# EAGLE design motorControllerMk3 (EAGLE 6.5.0)
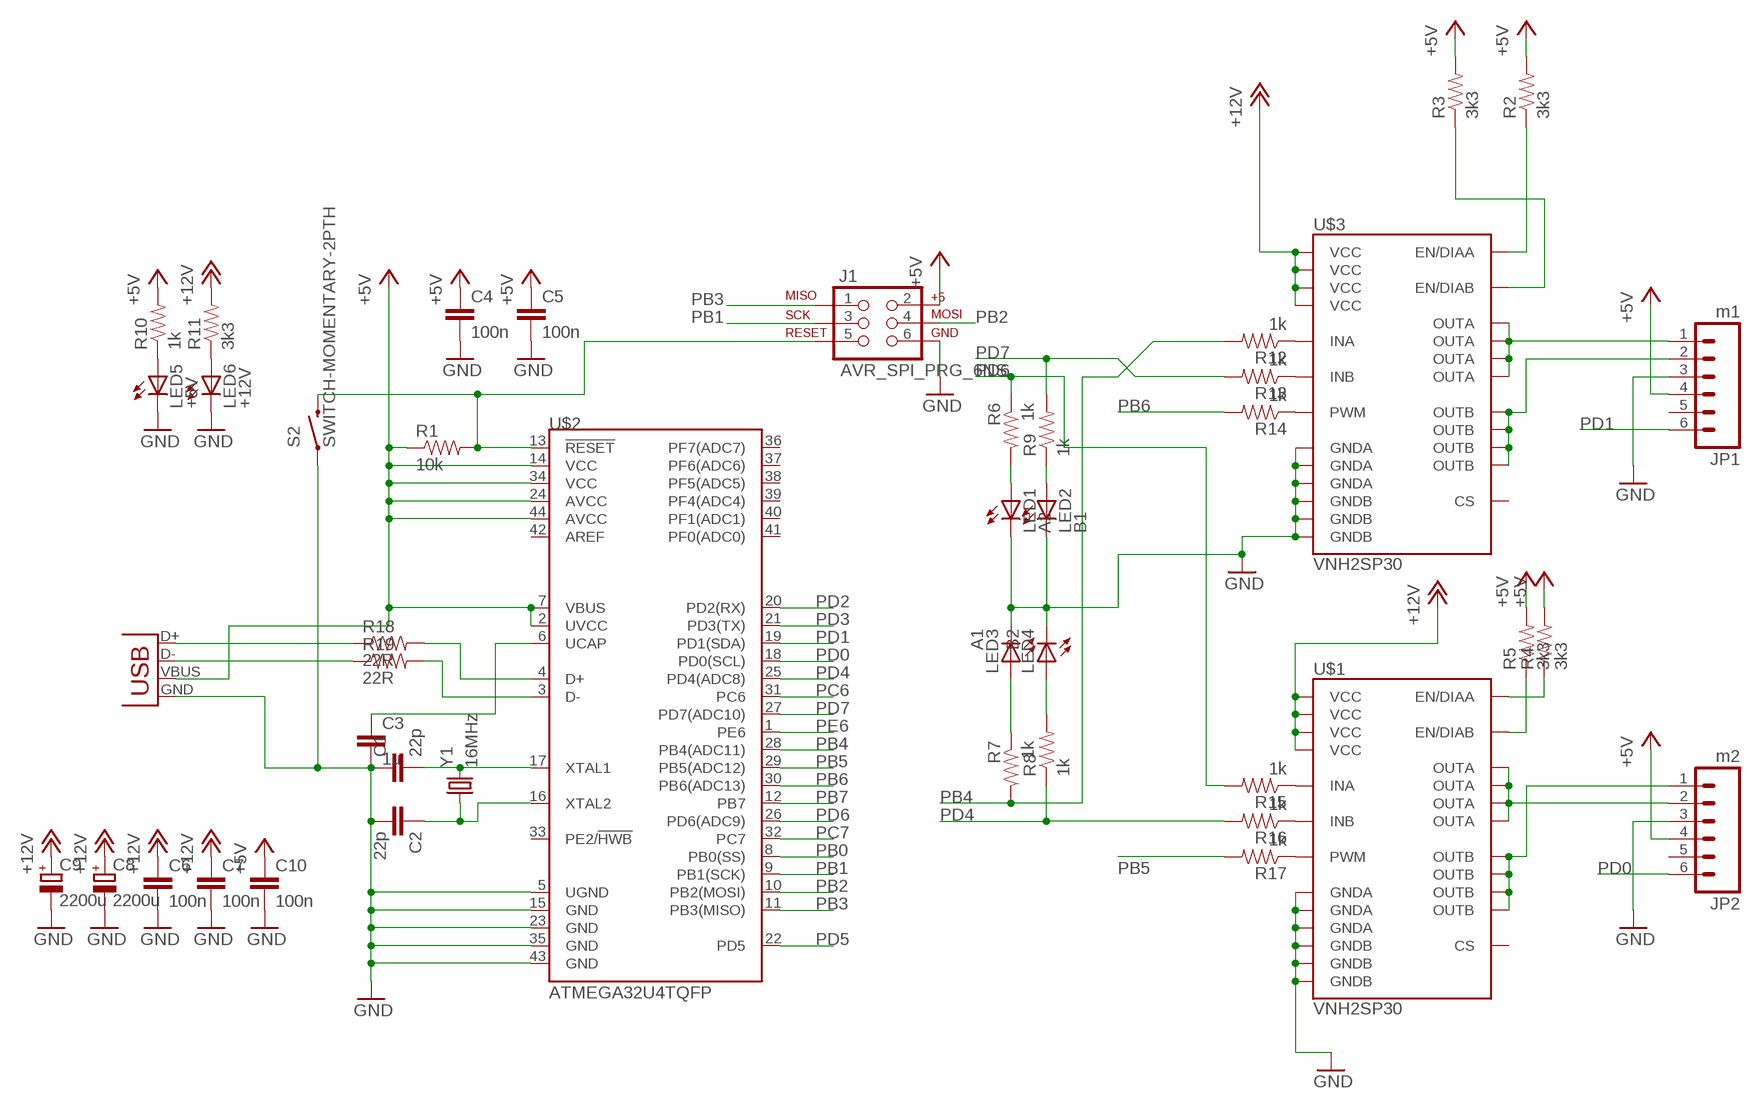
[diagram p0: schematic, sheet 1]

## Parts
C1  22p  CAP0805  [0805]
C2  22p  CAP0805  [0805]
C3  1u  CAP0805  [0805]
C4  100n  CAP0805  [0805]
C5  100n  CAP0805  [0805]
C6  100n  CAP0805  [0805]
C7  100n  CAP0805  [0805]
C8  2200u  CPOL-EUE5-8.5  [E5-8,5]
C9  2200u  CPOL-EUE5-8.5  [E5-8,5]
C10  100n  CAP0805  [0805]
J1  AVR_SPI_PRG_6NS  [2X3-NS]
JP1  m1  M06SIP  [1X06]
JP2  m2  M06SIP  [1X06]
JP3  USB-SMD-NS  [USB-MINIB-NOSTOP]
LED1  A2  LED1206  [LED-1206]
LED2  B1  LED1206  [LED-1206]
LED3  A1  LED1206  [LED-1206]
LED4  B2  LED1206  [LED-1206]
LED5  +5V  LED1206  [LED-1206]
LED6  +12V  LED1206  [LED-1206]
R1  10k  RESISTOR0805-RES  [0805]
R2  3k3  RESISTOR0805-RES  [0805]
R3  3k3  RESISTOR0805-RES  [0805]
R4  3k3  RESISTOR0805-RES  [0805]
R5  3k3  RESISTOR0805-RES  [0805]
R6  1k  RESISTOR0805-RES  [0805]
R7  1k  RESISTOR0805-RES  [0805]
R8  1k  RESISTOR0805-RES  [0805]
R9  1k  RESISTOR0805-RES  [0805]
R10  1k  RESISTOR0805-RES  [0805]
R11  3k3  RESISTOR0805-RES  [0805]
R12  1k  RESISTOR0805-RES  [0805]
R13  1k  RESISTOR0805-RES  [0805]
R14  1k  RESISTOR0805-RES  [0805]
R15  1k  RESISTOR0805-RES  [0805]
R16  1k  RESISTOR0805-RES  [0805]
R17  1k  RESISTOR0805-RES  [0805]
R18  22R  RESISTOR0805-RES  [0805]
R19  22R  RESISTOR0805-RES  [0805]
S2  SWITCH-MOMENTARY-2PTH  [TACTILE-PTH]
U$1  VNH2SP30  [VNH2SP30]
U$2  ATMEGA32U4TQFP  [SPARKFUN-DIGITALIC_TQFP44]
U$3  VNH2SP30  [VNH2SP30]
Y1  16MHz  CRYSTALHC49US  [HC49US]

## Nets
+5V: C4.1 C5.1 C10.1 J1.2 JP1.4 JP2.4 JP3.VBUS R1.1 R2.2 R3.2 R4.2 R5.2 R10.2 U$2.2(UVCC) U$2.7(VBUS) U$2.14(VCC) U$2.24(AVCC) U$2.34(VCC) U$2.44(AVCC)
+12V: C6.1 C7.1 C8.+ C9.+ R11.2 U$1.3(VCC) U$1.13(VCC) U$1.23(VCC) U$1.SLUG1(VCC) U$3.3(VCC) U$3.13(VCC) U$3.23(VCC) U$3.SLUG1(VCC)
GND: C1.1 C2.2 C3.2 C4.2 C5.2 C6.2 C7.2 C8.- C9.- C10.2 J1.6 JP1.3 JP2.3 JP3.GND LED1.C LED2.C LED3.C LED4.C LED5.C LED6.C S2.1 U$1.18(GNDB) U$1.19(GNDB) U$1.20(GNDB) U$1.26(GNDA) U$1.27(GNDA) U$1.28(GNDA) U$2.5(UGND) U$2.15(GND) U$2.23(GND) U$2.35(GND) U$2.43(GND) U$3.18(GNDB) U$3.19(GNDB) U$3.20(GNDB) U$3.26(GNDA) U$3.27(GNDA) U$3.28(GNDA)
N$1: R15.1 U$1.5(INA)
N$2: C2.1 U$2.16(XTAL2) Y1.1
N$3: C1.2 U$2.17(XTAL1) Y1.2
N$4: C3.1 U$2.6(UCAP)
N$5: R16.1 U$1.11(INB)
N$6: R17.1 U$1.8(PWM)
N$7: R5.1 U$1.10(EN/DIAB)
N$8: R4.1 U$1.6(EN/DIAA)
N$9: R12.1 U$3.5(INA)
N$10: R18.2 U$2.4(D+)
N$11: R19.2 U$2.3(D-)
N$12: R13.1 U$3.11(INB)
N$13: R14.1 U$3.8(PWM)
N$14: JP3.D+ R18.1
N$15: JP3.D- R19.1
N$16: LED3.A R7.1
N$17: R3.1 U$3.10(EN/DIAB)
N$18: LED1.A R6.2
N$20: R2.1 U$3.6(EN/DIAA)
N$22: LED4.A R8.2
N$28: LED5.A R10.1
N$29: LED6.A R11.1
N$30: LED2.A R9.1
N$38: J1.5 R1.2 S2.3 U$2.13(!RESET)
OUTA1: JP1.1 U$3.1(OUTA) U$3.25(OUTA) U$3.30(OUTA) U$3.SLUG3(OUTA)
OUTA2: JP2.2 U$1.1(OUTA) U$1.25(OUTA) U$1.30(OUTA) U$1.SLUG3(OUTA)
OUTB1: JP1.2 U$3.15(OUTB) U$3.16(OUTB) U$3.21(OUTB) U$3.SLUG2(OUTB)
OUTB2: JP2.1 U$1.15(OUTB) U$1.16(OUTB) U$1.21(OUTB) U$1.SLUG2(OUTB)
PB0: U$2.8(PB0(SS))
PB1: J1.3 U$2.9(PB1(SCK))
PB2: J1.4 U$2.10(PB2(MOSI))
PB3: J1.1 U$2.11(PB3(MISO))
PB4: R7.2 R12.2 U$2.28(PB4(ADC11))
PB5: R17.2 U$2.29(PB5(ADC12))
PB6: R14.2 U$2.30(PB6(ADC13))
PB7: U$2.12(PB7)
PC6: U$2.31(PC6)
PC7: U$2.32(PC7)
PD0: JP2.6 U$2.18(PD0(SCL))
PD1: JP1.6 U$2.19(PD1(SDA))
PD2: U$2.20(PD2(RX))
PD3: U$2.21(PD3(TX))
PD4: R8.1 R16.2 U$2.25(PD4(ADC8))
PD5: U$2.22(PD5)
PD6: R6.1 R15.2 U$2.26(PD6(ADC9))
PD7: R9.2 R13.2 U$2.27(PD7(ADC10))
PE6: U$2.1(PE6)
Unconnected: JP1.5 JP2.5 U$1.9(CS) U$2.33(PE2/!HWB) U$2.36(PF7(ADC7)) U$2.37(PF6(ADC6)) U$2.38(PF5(ADC5)) U$2.39(PF4(ADC4)) U$2.40(PF1(ADC1)) U$2.41(PF0(ADC0)) U$2.42(AREF) U$3.9(CS)

## Library data of the parts
C1-C7 C10 = SparkFun-Passives:CAP: Capacitor Standard 0603 ceramic capacitor, and 0.1" leaded capacitor.
C8 C9 = rcl:CPOL-EU: POLARIZED CAPACITOR, European symbol
J1 = SparkFun-Connectors:AVR_SPI_PRG_6: AVR ISP 6 Pin This is the reduced ISP connector for AVR programming. Common on Arduino. This footprint will take up less PCB space and can be used with a 10-pin to 6-pin adapter such as SKU: BOB-08508
JP1 JP2 = SparkFun-Connectors:M06: Header 6 Standard 6-pin 0.1" header. Use with straight break away headers (SKU : PRT-00116), right angle break away headers (PRT-00553), swiss pins (PRT-00743), machine pins (PRT-00117), and female headers (PRT-00115). Molex polarized connector foot print use with SKU : PRT-08094 with associated crimp pins and housings. NOTES ON THE VARIANTS LOCK and LOCK_LONGPADS... This footprint was designed to help hold the alignment of a through-hole component (i.e. 6-pin header) while soldering it into place. You may notice that each hole has been shifted either up or down by 0.005 of an inch from it's more standard position (which is a perfectly straight line). This slight alteration caused the pins (the squares in the middle) to touch the edges of the holes. Because they are alternating, it causes a "brace" to hold the component in place. 0.005 has proven to be the perfect amount of "off-center" position when using our standard breakaway headers. Although looks a little odd when you look at the bare footprint, once you have a header in there, the alteration is very hard to notice. Also,if you push a header all the way into place, it is covered up entirely on the bottom side. This idea of altering the position of holes to aid alignment will be further integrated into the Sparkfun Library for other footprints. It can help hold any component with 3 or more connection pins.
JP3 = SparkFun-Connectors:USB: USB Connectors USB-B-PTH is fully proven SKU : PRT-00139/CONN-08278 USB-miniB is fully proven SKU : PRT-00587 USB-A-PCB is untested. USB-A-H is throughly reviewed, but untested. Spark Fun Electronics SKU : PRT-00437 USB-B-SMT is throughly reviewed, but untested. Needs silkscreen touching up. USB-A-S has not been used/tested USB-MB-H has not been used/tested USB-MICROB has been used. CONN-09505
LED1-LED6 = SparkFun-LED:LED: LEDs Standard schematic elements and footprints for 5mm, 3mm, 1206, and 0603 sized LEDs. 5mm - Spark Fun Electronics SKU : COM-00529 (and others)
R1-R19 = SparkFun-Passives:RESISTOR: Resistor Basic schematic elements and footprints for 0603, 1206, and PTH resistors.
S2 = SparkFun-Electromechanical:SWITCH-MOMENTARY-2: Various NO switches- pushbuttons, reed, etc
U$1 U$3 = SparkFun-PowerIC:VNH2SP30: 30A motor driver IC
U$2 = SparkFun-DigitalIC:ATMEGA32U4: Atmel 44-pin 8-bit Microcontroller with 32KBytes of ISP Flash and USB Controller ----- Please use the QFN-44-NOPAD_1:1 package for the footprint of all boards using a 32U4. Route traces directly away from the pads as much as possible.; PROD_ID: IC-11161
Y1 = SparkFun-FreqCtrl:CRYSTAL: Various standard crystals. Proven footprints. Spark Fun Electronics SKU : COM-00534

## Board
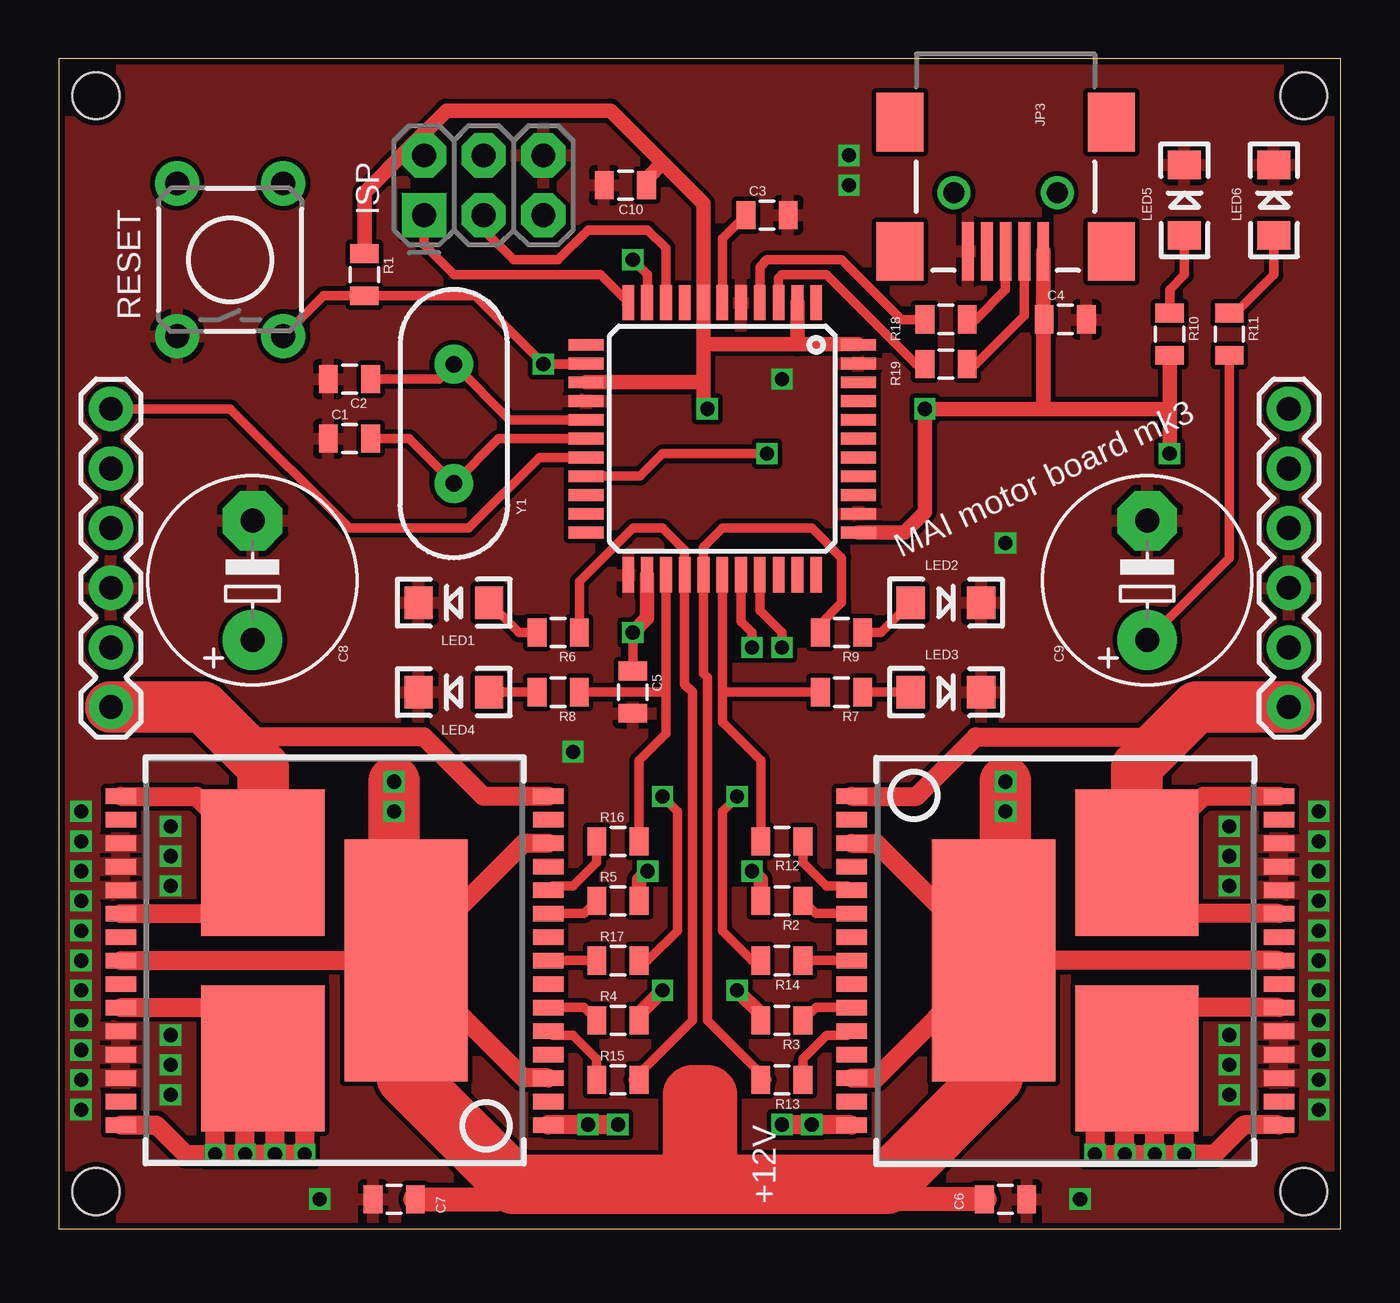
[diagram p1: board, top side]
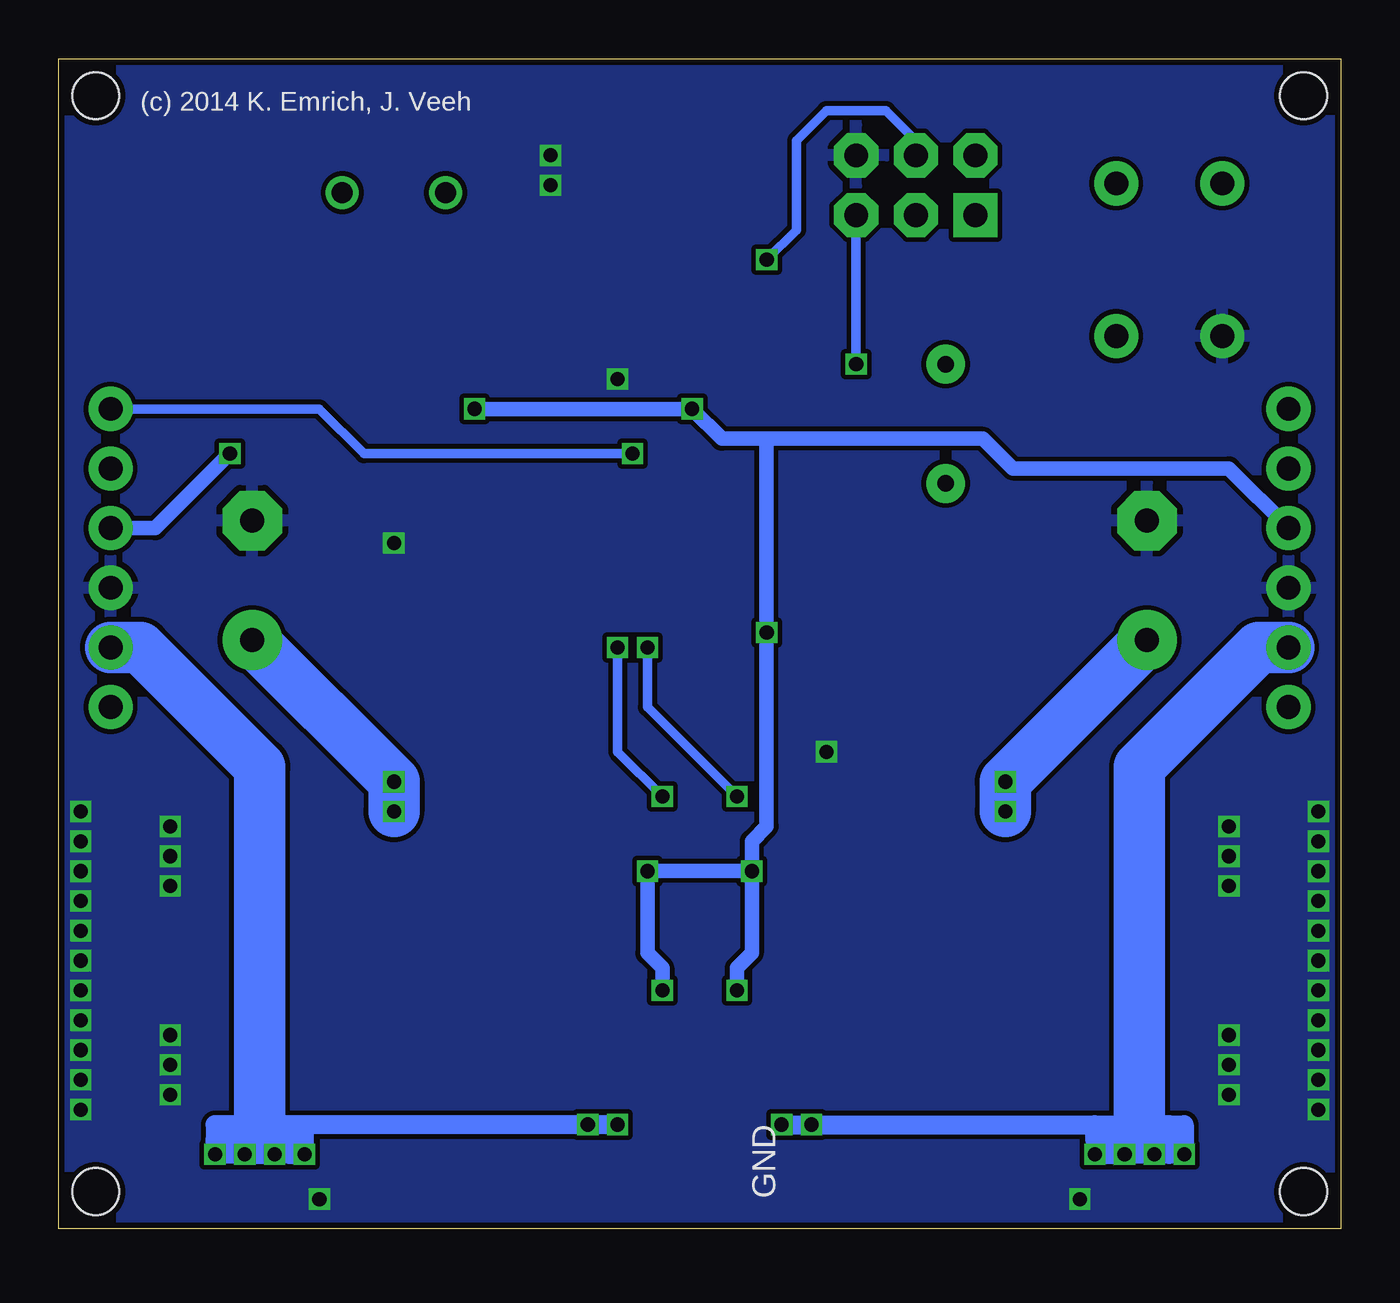
[diagram p2: board, bottom side, seen from below]

Size 54.6 x 49.84 mm. Coordinates in mm from the lower left corner, seen from the top.
Outline: 0,0 54.6,0 54.6,49.84 0,49.84 0,0
Copper layers (1*16): Top 0.035mm / dielectric 1.5mm / Bottom 0.035mm
Design rules "SeeedStudio_DRU_no_angle_2layer *": minimum track width 6mil, minimum drill 12mil, track to track 8mil, track to pad 8mil, pad to pad 8mil, via to via 8mil, smd to smd 0mil, copper to edge 10mil, drill to drill 10mil, minimum pad ring 10mil, minimum via ring 6mil, stop-mask expansion 2mil, vias tented up to drill 25mil, thermal gap 10mil
Holes 2 mm at 1.59,1.59 53.02,1.59 53.02,48.26 1.59,48.26

### Footprints (pad centres in the part's own frame; a part is rotated, then mirrored left to right if it is on the bottom)
0805 = smd 0.8 x 1.2: 1 -0.9,0; 2 0.9,0
E5-8,5 = drill 1.016 pad 2.54: + -2.54,0 | drill 1.016 pad 2.54 octagon: - 2.54,0
2X3-NS = drill 1.016 pad 1.88 square: 1 -2.54,-1.27 | drill 1.016 pad 1.88 octagon: 2 -2.54,1.27; 3 0,-1.27; 4 0,1.27; 5 2.54,-1.27; 6 2.54,1.27
1X06 = drill 1.016 pad 1.88: 1 0,0; 2 2.54,0; 3 5.08,0; 4 7.62,0; 5 10.16,0; 6 12.7,0
USB-MINIB-NOSTOP = smd 2.5 x 0.5: D+ 2.5,0; D- 2.5,0.8; GND 2.5,-1.6; ID 2.5,-0.8; VBUS 2.5,1.6 | smd 2.5 x 2: G1 -3,-4.5; G2 -3,4.5; G3 2.5,4.5; G4 2.5,-4.5 | drill 0.9 pad 0.8: H1 0,2.2 | drill 0.9 pad 0.787: H2 0,-2.2
LED-1206 = smd 1.2 x 1.4: A -1.5,0; C 1.5,0
TACTILE-PTH = drill 1.016 pad 1.88: 1 -3.251,2.261; 2 3.251,2.261; 3 -3.251,-2.261; 4 3.251,-2.261
VNH2SP30 = smd 0.67 x 1.3: 1 -7,-9.1; 2 -6,-9.1; 3 -5,-9.1; 4 -4,-9.1; 5 -3,-9.1; 6 -2,-9.1; 7 -1,-9.1; 8 0,-9.1; 9 1,-9.1; 10 2,-9.1; 11 3,-9.1; 12 4,-9.1; 13 5,-9.1; 14 6,-9.1; 15 7,-9.1; 16 7,9.1; 17 6,9.1; 18 5,9.1; 19 4,9.1; 20 3,9.1; 21 2,9.1; 22 1,9.1; 23 0,9.1; 24 -1,9.1; 25 -2,9.1; 26 -3,9.1; 27 -4,9.1; 28 -5,9.1; 29 -6,9.1; 30 -7,9.1 | smd 10.3 x 5.25: SLUG1 0,-3.05 | smd 6.23 x 5.25: SLUG2 4.165,3.05; SLUG3 -4.165,3.05
SPARKFUN-DIGITALIC_TQFP44 = smd 1.5 x 0.5: 1 -5.8,4; 2 -5.8,3.2; 3 -5.8,2.4; 4 -5.8,1.6; 5 -5.8,0.8; 6 -5.8,0; 7 -5.8,-0.8; 8 -5.8,-1.6; 9 -5.8,-2.4; 10 -5.8,-3.2; 11 -5.8,-4; 23 5.8,-4; 24 5.8,-3.2; 25 5.8,-2.4; 26 5.8,-1.6; 27 5.8,-0.8; 28 5.8,0; 29 5.8,0.8; 30 5.8,1.6; 31 5.8,2.4; 32 5.8,3.2; 33 5.8,4 | smd 0.5 x 1.5: 12 -4,-5.8; 13 -3.2,-5.8; 14 -2.4,-5.8; 15 -1.6,-5.8; 16 -0.8,-5.8; 17 0,-5.8; 18 0.8,-5.8; 19 1.6,-5.8; 20 2.4,-5.8; 21 3.2,-5.8; 22 4,-5.8; 34 4,5.8; 35 3.2,5.8; 36 2.4,5.8; 37 1.6,5.8; 38 0.8,5.8; 39 0,5.8; 40 -0.8,5.8; 41 -1.6,5.8; 42 -2.4,5.8; 43 -3.2,5.8; 44 -4,5.8
HC49US = drill 0.7 pad 1.651: 1 -2.54,0; 2 2.54,0

### Placement (x,y rotation side)
C1  12.38,33.66 0 top
C2  12.38,36.2 180 top
C3  30.16,43.18 0 top
C4  42.86,38.73 0 top
C5  24.45,22.86 270 top
C6  40.32,1.27 0 top
C7  14.29,1.27 180 top
C8  8.26,27.62 90 top
C9  46.35,27.62 90 top
C10  24.13,44.45 180 top
J1  18.1,44.45 0 top
JP1  52.39,22.23 90 top
JP2  2.22,22.23 90 top
JP3  40.32,44.13 270 top
LED1  16.83,26.67 180 top
LED2  37.78,26.67 0 top
LED3  37.78,22.86 0 top
LED4  16.83,22.86 180 top
LED5  47.94,43.81 90 top
LED6  51.75,43.81 90 top
R1  13.02,40.64 270 top
R2  30.8,13.97 180 top
R3  30.8,8.89 180 top
R4  23.81,8.89 0 top
R5  23.81,13.97 0 top
R6  21.27,25.4 180 top
R7  33.34,22.86 180 top
R8  21.27,22.86 180 top
R9  33.34,25.4 180 top
R10  47.31,38.1 270 top
R11  49.85,38.1 270 top
R12  30.8,16.51 180 top
R13  30.8,6.35 180 top
R14  30.8,11.43 180 top
R15  23.81,6.35 0 top
R16  23.81,16.51 0 top
R17  23.81,11.43 0 top
R18  37.78,38.73 180 top
R19  37.78,36.83 180 top
S2  7.3,41.27 90 top
U$1  11.75,11.43 90 top
U$2  28.26,33.66 270 top
U$3  42.86,11.43 270 top
Y1  16.83,34.29 270 top

### Tracks (layer width: path | path; a pad name or v marks a point on that pad's centre or on a via)
+5V  (via drill 0.6)
  Top 0.406: 34.03,37.68 U$2.44 | 41.92,38.73 C4.1 | C5.1 v24.45,25.4
  Top 0.61: R5.2 24.71,14.87 v25.08,15.24 | U$2.2 31.46,37.68 | 27.46,36.05 27.46,37.68 | 27.46,37.68 U$2.7 27.46,43.66 25.72,45.4 | 34.03,37.68 31.46,37.68 | v27.62,34.92 27.46,34.92 27.46,36.05 | U$2.14 27.46,36.05 | R1.1 13.02,44.13 14.92,46.04 | 14.92,46.04 16.51,47.62 23.5,47.62 25.72,45.4 | U$2.24 25.06,26.01 v24.45,25.4 | R2.2 29.9,14.87 v29.53,15.24 | R3.2 29.9,9.15 v28.89,10.16 | R4.2 24.71,9.15 v25.72,10.16 | C4.1 41.92,38.77 JP3.VBUS | 41.92,38.73 41.92,34.92 | 41.92,34.92 v36.88,34.92 36.88,30.53 36.01,29.66 U$2.34 | R10.2 47.31,34.92 | 47.31,34.92 41.92,34.92 | 47.31,34.92 v47.31,33.02 | 31.46,37.68 27.46,37.68 | J1.2 15.24,46.04 14.92,46.04 | C10.1 25.03,44.72 25.72,45.4
  Bottom 0.61: v25.08,15.24 25.08,11.75 25.72,11.11 v25.72,10.16 | v25.08,15.24 v29.53,15.24 29.53,11.75 28.89,11.11 v28.89,10.16 | v25.08,15.24 25.08,16.51 24.45,17.14 v24.45,25.4 24.45,33.66 | 24.45,33.66 15.24,33.66 13.97,32.38 4.76,32.38 JP2.4 | 24.45,33.66 26.35,33.66 v27.62,34.92 v36.88,34.92 | v47.31,33.02 50.48,29.84 JP1.4
+12V  (via drill 0.6)
  Top 0.406: R11.2 49.85,28.57 C9.+
  Top 0.813: U$1.23 U$1.SLUG1 | U$1.3 19.8,6.43 U$1.SLUG1 | U$1.13 19.8,16.43 15.18,11.81 U$1.SLUG1 | U$3.23 40.96,11.43 U$3.SLUG1 | U$3.3 34.81,16.43 U$3.SLUG1 | U$3.13 34.81,6.43 U$3.SLUG1
  Top 1.016: C7.1 18.73,1.27 19.37,1.91 | C6.1 35.88,1.27 35.24,1.91
  Top 2.184: 15.18,11.81 14.29,12.7 v14.29,19.05 | 40.96,11.43 39.05,11.43 40.32,12.7 v40.32,19.05
  Top 2.54: U$1.SLUG1 14.8,6.47 19.37,1.91 26.99,1.91 | U$3.SLUG1 39.81,6.47 35.24,1.91 27.62,1.91 | 26.99,1.91 27.62,1.91 | 27.62,1.91 27.62,5.71 26.99,5.71 26.99,1.91
  Bottom 2.184: v14.29,17.78 v14.29,19.05 C8.+ | v40.32,17.78 v40.32,19.05 C9.+
GND  (via drill 0.6)
  other vias: 40.32,29.21 30.8,36.2 0.95,6.35 0.95,7.62 53.66,16.51 53.66,15.24 53.66,8.89 53.66,7.62 53.66,6.35 43.5,1.27 0.95,13.97 0.95,15.24 0.95,16.51 0.95,8.89 53.66,13.97 53.66,5.08 53.66,10.16 53.66,11.43 53.66,12.7 53.66,17.78 11.11,1.27 0.95,10.16 0.95,11.43 0.95,12.7 0.95,17.78 0.95,5.08 4.76,17.14 4.76,15.88 4.76,14.61 4.76,8.26 4.76,6.99 4.76,5.71 49.85,8.26 49.85,6.99 49.85,5.71 49.85,14.61 49.85,15.88 49.85,17.14 21.91,20.32 33.66,45.72 33.66,44.45
  pour Top: 3.49,16.51 0.95,16.51 0.95,13.97 3.49,13.97
  pour Top: 3.49,8.89 0.95,8.89 0.95,6.35 3.49,6.35
  pour Top: 54.29,8.89 51.12,8.89 51.12,6.35 54.29,6.35
  pour Top: 53.98,16.51 51.12,16.51 51.12,13.97 53.98,13.97
  pour Bottom: 0.32,49.53 54.29,49.53 54.29,0 0.32,0
  pour Top: 0.32,49.53 54.29,49.53 54.29,0 0.32,0
N$1
  Top 0.406: R15.1 22.91,7.25 21.91,8.26 21.02,8.26 U$1.5
N$2
  Top 0.406: C2.1 16.19,36.2 Y1.1 19.2,34.45 U$2.16
N$3
  Top 0.406: C1.2 14.92,33.66 Y1.2 18.73,33.66 U$2.17
N$4
  Top 0.406: U$2.6 28.26,42.17 C3.1
N$5
  Top 0.406: R16.1 22.91,15.61 21.91,14.61 21.02,14.61 U$1.11
N$6
  Top 0.406: U$1.8 R17.1
N$7
  Top 0.406: U$1.10 22.37,13.43 R5.1
N$8
  Top 0.406: U$1.6 22.37,9.43 R4.1
N$9
  Top 0.406: R12.1 31.7,15.61 32.7,14.61 33.59,14.61 U$3.5
N$10
  Top 0.406: U$2.4 29.86,40.97 30.16,41.27 33.34,41.27 35.88,38.73 R18.2
N$11
  Top 0.406: R19.2 36.51,36.83 32.7,40.64 30.8,40.64 30.66,40.5 U$2.3
N$12
  Top 0.406: R13.1 31.7,7.25 32.7,8.26 33.59,8.26 U$3.11
N$13
  Top 0.406: R14.1 U$3.8
N$14
  Top 0.406: JP3.D+ 40.32,40.01 39.05,38.73 R18.1
N$15
  Top 0.406: JP3.D- 41.12,38.9 39.05,36.83 R19.1
N$16
  Top 0.406: R7.1 LED3.A
N$17
  Top 0.406: R3.1 32.24,9.43 U$3.10
N$18
  Top 0.406: R6.2 19.6,25.4 LED1.A
N$20
  Top 0.406: R2.1 32.24,13.43 U$3.6
N$22
  Top 0.406: LED4.A R8.2
N$28
  Top 0.406: R10.1 47.31,40.01 47.94,40.64 LED5.A
N$29
  Top 0.406: R11.1 50.11,39 51.75,40.64 LED6.A
N$30
  Top 0.406: R9.1 35.01,25.4 LED2.A
N$38  (via drill 0.6)
  Top 0.406: U$2.13 22.43,36.83 v20.64,36.83 17.73,39.74 R1.2 11.28,39.74 S2.3
  Bottom 0.406: J1.5 v20.64,36.83
OUTA1
  Top 0.813: U$3.25 48.08,13.43 U$3.SLUG3 48.75,18.43 U$3.30 | 45.9,18.43 45.91,18.41 | U$3.1 36.53,18.43 39.05,20.95 46.45,20.95 46.45,20.22
  Top 2.184: U$3.SLUG3 45.91,18.41 45.91,19.68 46.45,20.22 48.45,22.23 JP1.1
OUTA2  (via drill 0.6)
  Top 0.813: U$1.25 6.53,9.43 U$1.SLUG3 9.21,6.75 9.21,6.35 | U$1.30 4.14,4.43 5.4,3.17 v6.67,3.17 | v9.21,3.17 9.21,6.35 | v7.94,3.17 7.94,5.08 | 7.94,5.08 7.94,5.71 8.57,5.71 8.57,6.35 9.21,6.35 | v6.67,3.17 6.67,5.08 7.94,5.08 | v6.67,3.17 v10.48,3.17 10.48,5.71 9.84,5.71 | v23.81,4.45 v22.54,4.45 20.85,4.45 U$1.1
  Bottom 0.813: v23.81,4.45 10.48,4.45 | 10.48,4.45 9.21,4.45 | 9.21,4.45 8.57,4.45 7.94,4.45 | v6.67,3.17 v7.94,3.17 | v7.94,3.17 v9.21,3.17 | 7.3,4.45 6.67,4.45 v6.67,3.17 | v6.67,3.17 7.3,3.17 7.3,4.45 | 7.3,4.45 7.94,4.45 | 7.94,4.45 v7.94,3.17 | 9.21,4.45 9.21,3.81 | v10.48,3.17 v9.21,3.17 | v9.21,3.17 9.21,3.81 | 9.21,3.81 10.48,3.81 10.48,4.45
  Bottom 2.184: JP2.2 3.49,24.77 8.57,19.68 8.57,4.45
OUTB1  (via drill 0.6)
  Top 0.813: U$3.21 48.08,9.43 U$3.SLUG2 44.25,5.6 | U$3.15 30.81,4.43 v30.8,4.45 | U$3.16 50.47,4.43 49.21,3.17 v47.94,3.17 | 44.25,5.6 44.13,5.49 v44.13,3.17 v47.94,3.17 | v45.4,3.17 45.4,4.45 | 45.4,4.45 44.25,5.6 | v46.67,3.17 46.67,4.45 | 46.67,4.45 45.4,4.45 | v47.94,3.17 47.94,4.45 46.67,4.45
  Bottom 0.813: v32.07,4.45 v30.8,4.45 47.94,4.45 v47.94,3.17 | 46.04,4.45 46.04,3.81 47.94,3.81 v47.94,3.17 | v47.94,3.17 v46.67,3.17 v45.4,3.17 45.4,3.81 | 44.77,4.45 44.77,3.17 v44.13,3.17 44.13,4.45
  Bottom 2.184: 46.04,4.45 46.04,19.68 51.12,24.77 JP1.2
OUTB2
  Top 0.813: U$1.21 6.53,13.43 U$1.SLUG2 5.86,18.43 U$1.16 | 8.71,18.43 8.7,18.41 | U$1.15 18.08,18.43 15.56,20.95 8.48,20.95 8.48,19.91
  Top 2.184: U$1.SLUG2 8.7,18.41 8.7,19.68 8.48,19.91 6.16,22.23 JP2.1
PB1
  Top 0.406: U$2.9 25.86,41.77 25.08,42.55 22.54,42.55 21.27,41.27 19.37,41.27 18.1,42.55 J1.3
PB2  (via drill 0.6)
  Top 0.406: U$2.10 25.08,39.48 25.08,40.64 v24.45,41.27
  Bottom 0.406: J1.4 18.1,46.35 19.37,47.62 21.91,47.62 23.18,46.35 23.18,42.55 v24.45,41.27
PB3
  Top 0.406: 24.17,39.37 U$2.11 23.07,40.64 16.83,40.64 15.56,41.91 J1.1
PB4
  Top 0.406: U$2.28 28.26,22.86 | 28.26,22.86 28.26,21.59 29.9,19.95 R12.2 | R7.2 28.26,22.86
PB5  (via drill 0.6)
  Top 0.406: R17.2 25.08,11.43 26.35,12.7 26.35,17.78 v25.72,18.41 | U$2.29 29.06,25.87 29.53,25.4 v29.53,24.77
  Bottom 0.406: v29.53,24.77 29.53,22.23 v25.72,18.41
PB6  (via drill 0.6)
  Top 0.406: R14.2 29.53,11.43 28.26,12.7 28.26,17.78 v28.89,18.41 | U$2.30 29.86,26.34 30.8,25.4 v30.8,24.77
  Bottom 0.406: v30.8,24.77 30.8,20.32 v28.89,18.41
PD0
  Top 0.406: JP2.6 7.3,34.92 12.38,29.84 17.46,29.84 20.47,32.85 U$2.18
PD1  (via drill 0.6)
  Top 0.406: v30.16,33.02 25.72,33.02 24.75,32.05 U$2.19
  Bottom 0.406: v30.16,33.02 41.59,33.02 43.5,34.92 JP1.6
PD4
  Top 0.406: 25.86,22.86 25.86,21.09 24.71,19.95 R16.2 | R8.1 25.86,22.86 | U$2.25 25.86,22.86
PD6
  Top 0.406: R15.2 24.45,6.35 26.99,8.89 26.99,22.86 26.66,23.19 U$2.26 26.66,28.91 25.72,29.84 24.45,29.84 22.17,27.57 R6.1
PD7
  Top 0.406: R13.2 30.16,6.35 27.62,8.89 27.62,23.5 27.46,23.66 U$2.27 27.46,29.05 28.26,29.84 32.07,29.84 33.34,28.57 33.34,26.67 32.44,25.77 R9.2

### Text on the board
tPlace: MAI motor board mk3
tNames: ISP | RESET | +12V
bNames: (c) 2014 K. Emrich, J. Veeh | GND